# Altium schematic sheet MicroController.SchDoc
size A4; CompanyName: AUVIC; DrawnBy: Aman Nijjar; Organization: AUVIC; DocumentNumber: 2; Revision: 0; SheetNumber: 2; SheetTotal: 3; DocumentName: Pinger; ProjectName: Pinger
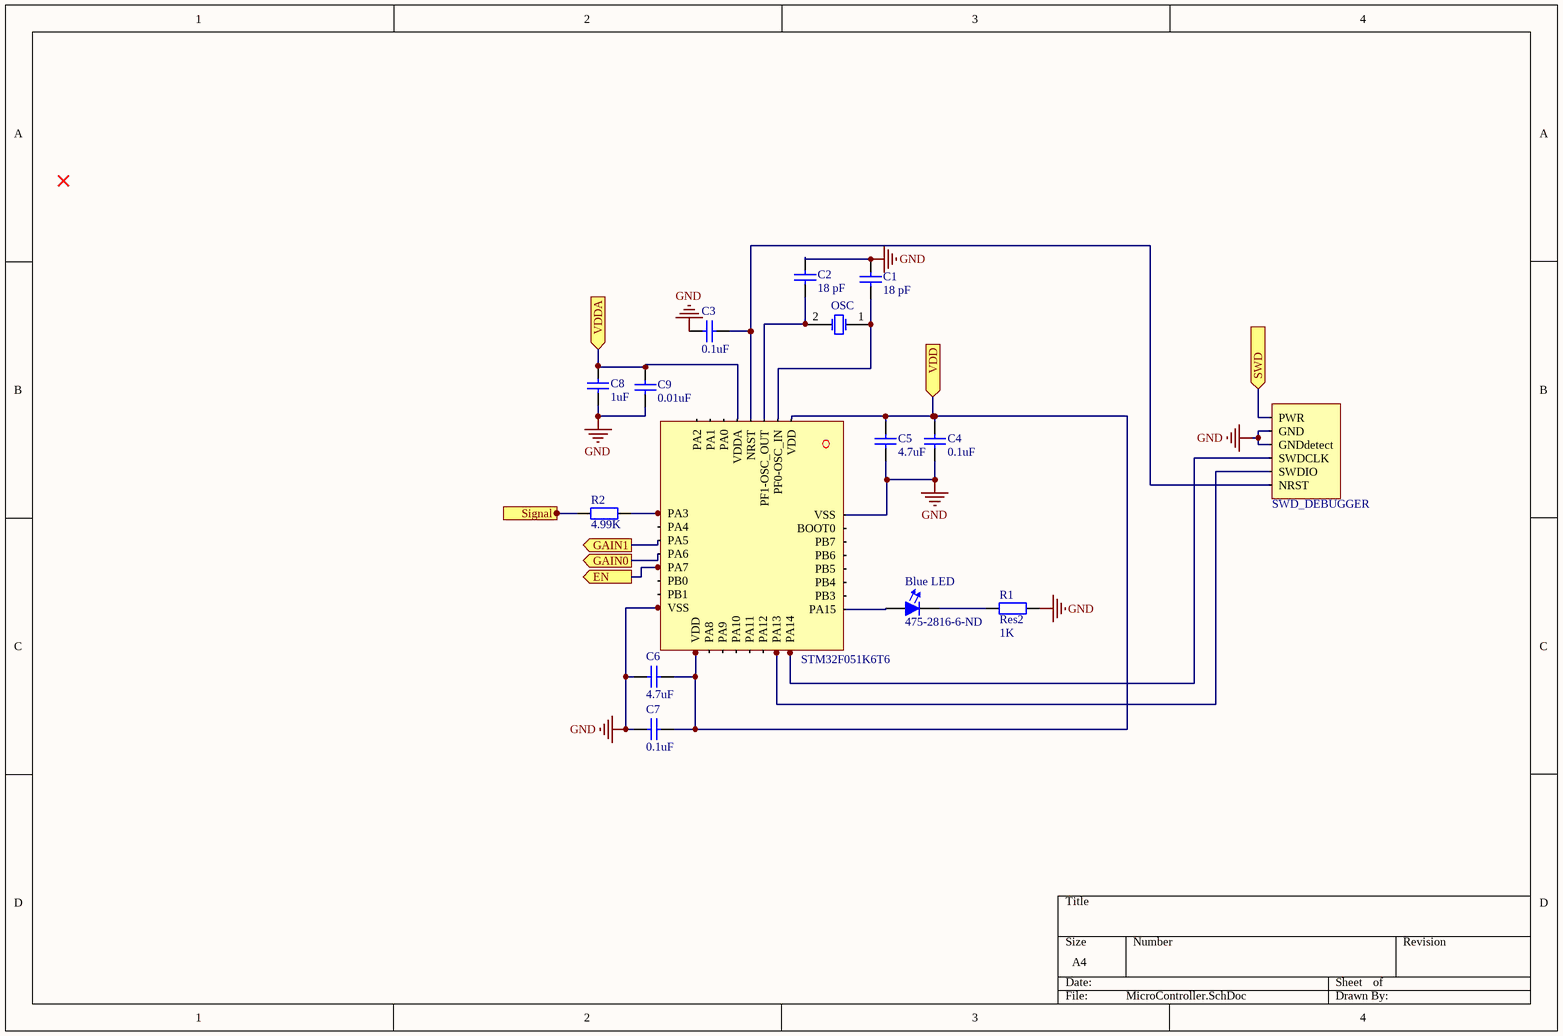
[diagram p0: MicroController.SchDoc]

## Parts
Blue_LED  Supplier Part Number 1: 475-2816-6-ND  [LED0603]  (hidden comment: Blue)
C1  value 18 pF  [CAPC1608N(0603")]  (hidden comment: Cap)
C2  value 18 pF  [CAPC1608N(0603")]  (hidden comment: Cap)
C3  value 0.1uF  [CAPC1608N(0603")]  (hidden comment: Cap)
C4  value 0.1uF  [CAPC1608N(0603")]  (hidden comment: Cap)
C5  value 4.7uF  [CAPC1608N(0603")]  (hidden comment: Cap)
C6  value 4.7uF  [CAPC1608N(0603")]  (hidden comment: Cap)
C7  value 0.1uF  [CAPC1608N(0603")]  (hidden comment: Cap)
C8  value 1uF  [CAPC1608N(0603")]  (hidden comment: Cap)
C9  value 0.01uF  [CAPC1608N(0603")]  (hidden comment: Cap)
DEBUG  SWD_DEBUGGER  [Male_header]
OSC  ABMM2-14.7456MHZ-E2-T  [*OSCSC320X250X100N]  (value not drawn)
R1  Res2  value 1K  [RESC1608N(0603")]
R2  value 4.99K  [RESC1608N(0603")]  (hidden comment: Res2)
STM  STM32F051K6T6  [TQFP68P900X900X160-32N]

## Ports
EN (out), GAIN0 (out), GAIN1 (out), Signal (out), SWD (in), VDD (in), VDDA (in)

## Nets
GND: C1.2 C2.2 C3.1 C4.2 C5.2 C6.2 C7.2 C8.2 C9.2 DEBUG.2(GND) DEBUG.3(GNDdetect) R1.2 STM.16(VSS) STM.32(VSS)
EN: STM.13(PA7) ; port EN
GAIN0: STM.12(PA6) ; port GAIN0
GAIN1: STM.11(PA5) ; port GAIN1
Signal: R2.1 ; port Signal
SWD: DEBUG.1(PWR) ; port SWD
VDD: C4.1 C5.1 C6.1 C7.1 STM.17(VDD) ; port VDD
VDDA: C8.1 C9.1 ; port VDDA
NetBlue_LED_1: Blue_LED.1(Cathode) R1.1
NetBlue_LED_2: Blue_LED.2(Anode) STM.25(PA15)
NetC1_1: C1.1 OSC.1(OSC1)
NetC2_1: C2.1 OSC.2(OSC2) STM.3(PF1-OSC_OUT)
NetC3_2: C3.2 DEBUG.6(NRST) STM.4(NRST)
NetDEBUG_4: DEBUG.4(SWDCLK) STM.24(PA14)
NetDEBUG_5: DEBUG.5(SWDIO) STM.23(PA13)
NetR2_2: R2.2 STM.9(PA3)

Not connected (* = marked no-connect by the designer): STM 1(VDD) 2(PF0-OSC_IN) 5(VDDA) 6(PA0) 7(PA1) 8(PA2) 10(PA4) 14(PB0) 15(PB1) 18(PA8) 19(PA9) 20(PA10) 21(PA11) 22(PA12) 26(PB3) 27(PB4) 28(PB5) 29(PB6) 30(PB7) 31(BOOT0)

## Library data of the parts
Blue_LED = LED, 0603 (1608), Blue, Clear: Colour: Blue; Created By: Lyden Smith; Date Created: 2017-09-19; Supplier 1: Digi-Key
C1-C9 = Cap: Capacitor; Published: 8-Jun-2000; LatestRevisionDate: 17-Jul-2002; LatestRevisionNote: Re-released for DXP Platform.; PackageReference: RAD-0.3; Publisher: Altium Limited; PackageDescription: Radial Cap, Thru-Hole; 2 Leads; 0.3 in Pin Spacing
DEBUG = SWD_Header
OSC = XTAL: Crystal Oscillator; Published: 8-Jun-2000; LatestRevisionDate: 17-Jul-2002; LatestRevisionNote: Re-released for DXP Platform.; PackageReference: R38; Publisher: Altium Limited; PackageDescription: Crystal, Thru-Hole; 2 Leads; Body 3.1 x 8.2 mm (Dia.xH)
R1 R2 = Res2: Resistor; Published: 8-Jun-2000; LatestRevisionDate: 17-Jul-2002; LatestRevisionNote: Re-released for DXP Platform.; PackageReference: AXIAL-0.4; Publisher: Altium Limited; PackageDescription: Axial Device, Thru-Hole; 2 Leads; 0.4 in Pin Spacing
STM = STM32F051K6T6: Supplier 1: Mouser; Supplier Part Number 1: 511-STM32F051K6T6